# EAGLE schematic cape-c (EAGLE 6.6.0)
DATABASE: ../partsdb.txt
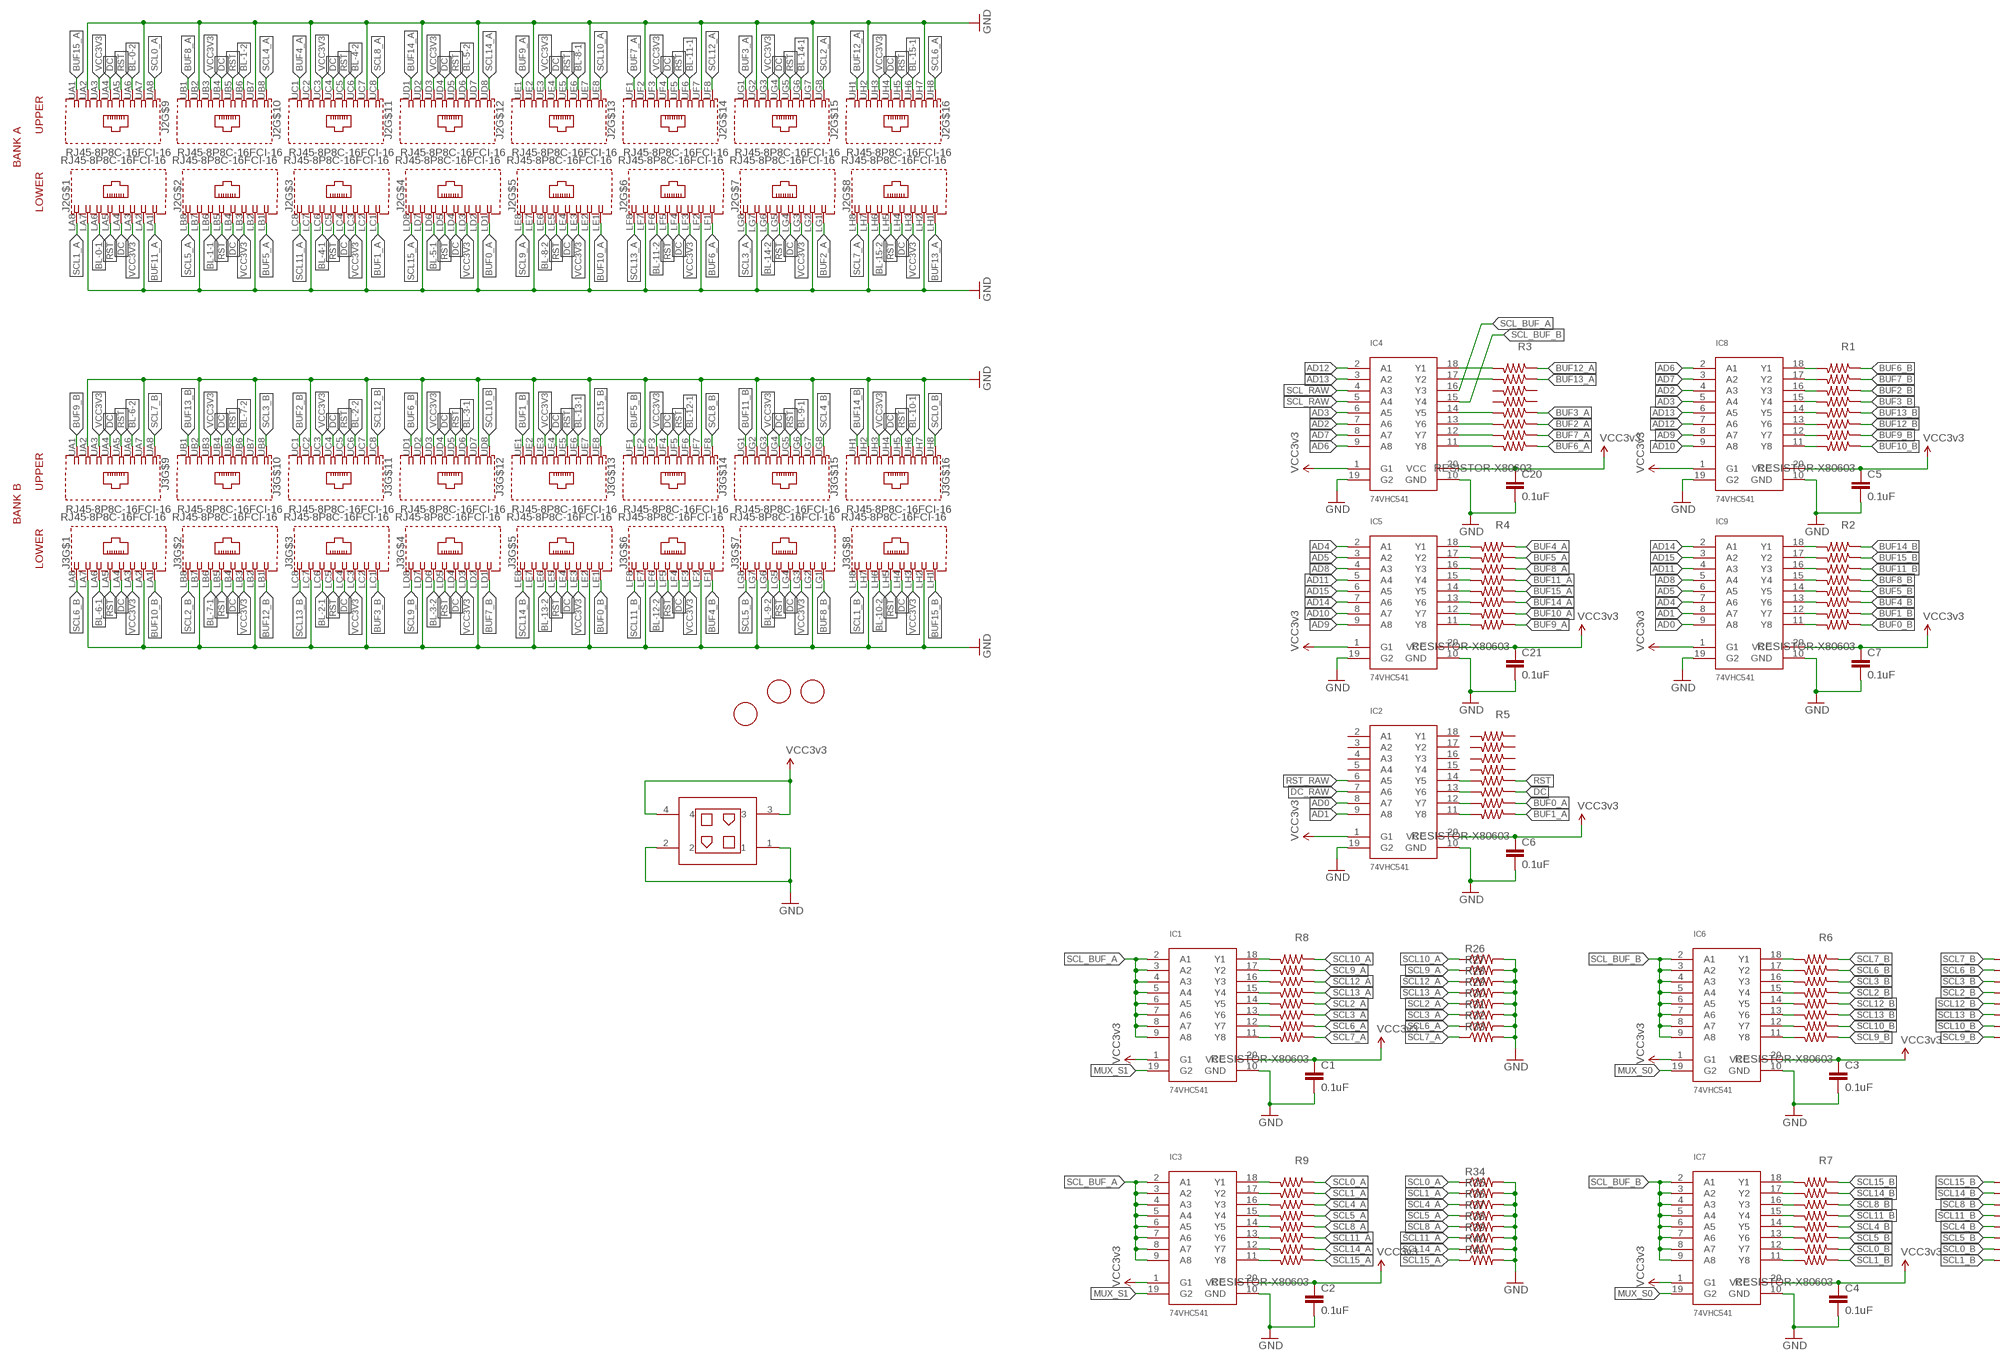
[diagram p0: schematic, sheet 1, part 1 of 2]
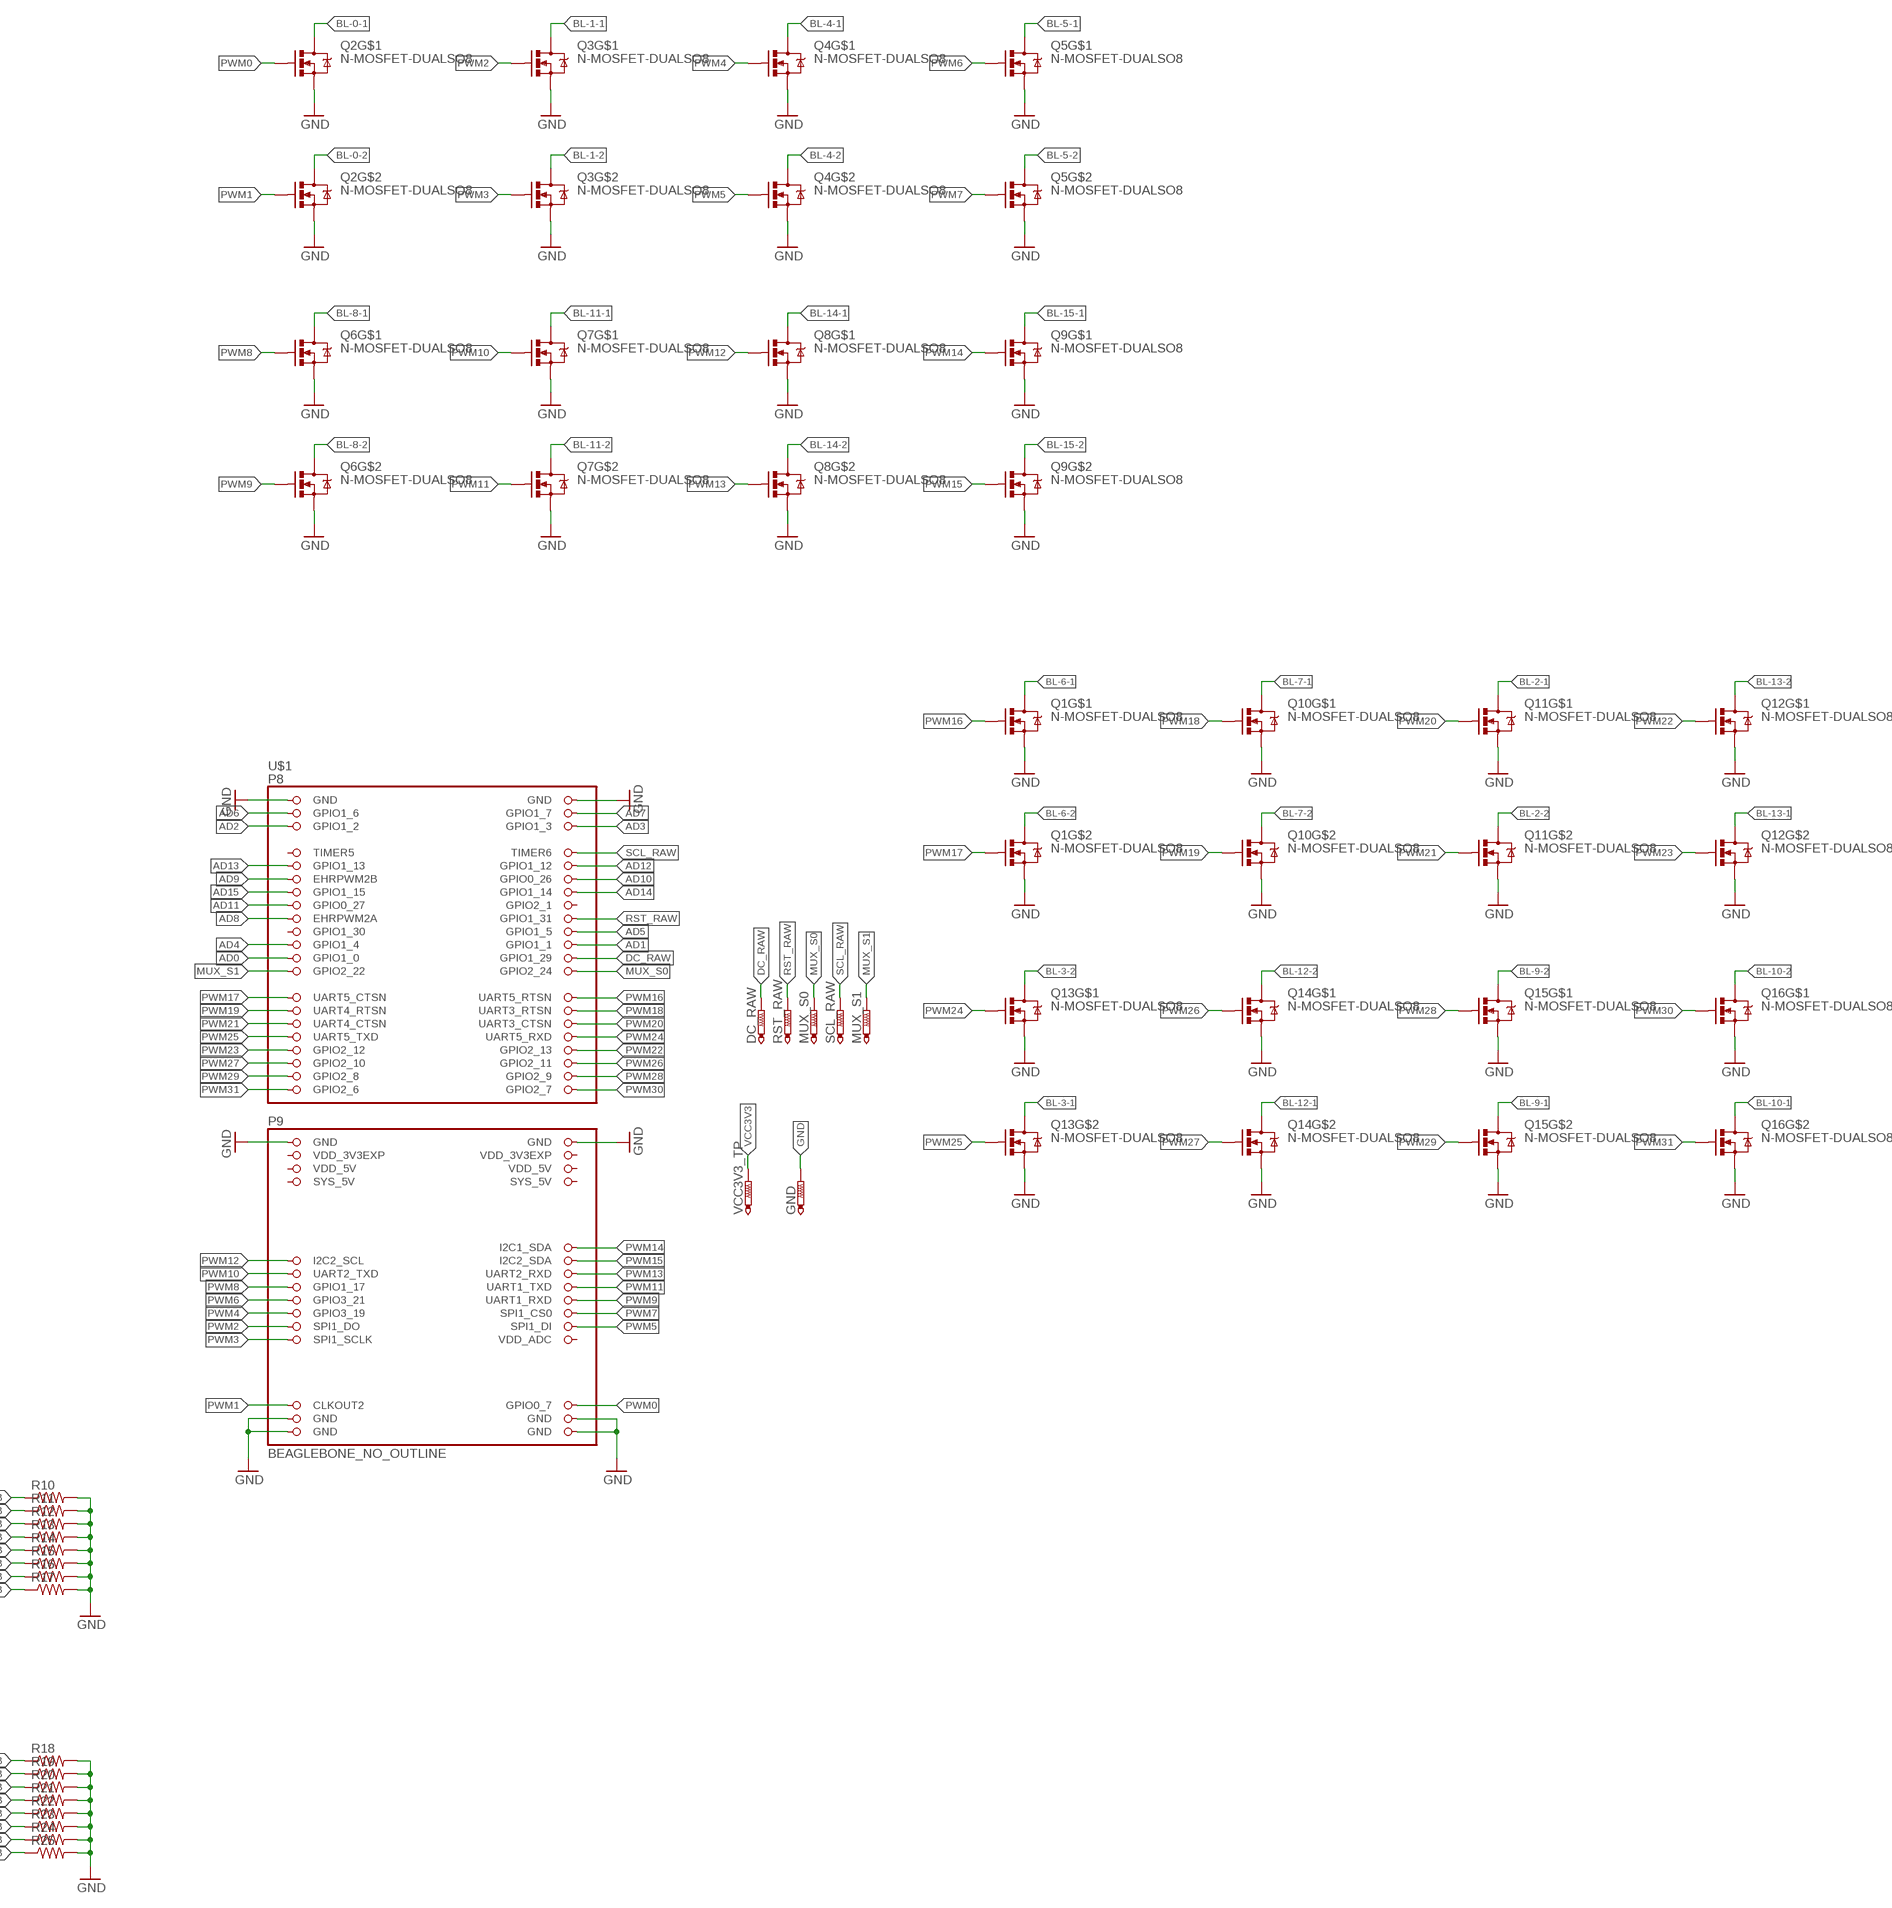
[diagram p1: schematic, sheet 1, part 2 of 2]

## Parts
C1  0.1uF  CAP0805  [0805]
C2  0.1uF  CAP0805  [0805]
C3  0.1uF  CAP0805  [0805]
C4  0.1uF  CAP0805  [0805]
C5  0.1uF  CAP0805  [0805]
C6  0.1uF  CAP0805  [0805]
C7  0.1uF  CAP0805  [0805]
C20  0.1uF  CAP0805  [0805]
C21  0.1uF  CAP0805  [0805]
DC_RAW  PTR1TP10R  [TP10R]
GND  PTR1TP15SQ  [TP15SQ]
IC1  74VHC541  [TSSOP20]
IC2  74VHC541  [TSSOP20]
IC3  74VHC541  [TSSOP20]
IC4  74VHC541  [TSSOP20]
IC5  74VHC541  [TSSOP20]
IC6  74VHC541  [TSSOP20]
IC7  74VHC541  [TSSOP20]
IC8  74VHC541  [TSSOP20]
IC9  74VHC541  [TSSOP20]
J1  MOLEX-P4  [MOLEX-P4]
J2  RJ45-8P8C-16FCI-16  [FCI-10118074-500A010LF]
J3  RJ45-8P8C-16FCI-16  [FCI-10118074-500A010LF]
MUX_S0  PTR1TP10R  [TP10R]
MUX_S1  PTR1TP10R  [TP10R]
Q1  N-MOSFET-DUALSO8  [SO8]
Q2  N-MOSFET-DUALSO8  [SO8]
Q3  N-MOSFET-DUALSO8  [SO8]
Q4  N-MOSFET-DUALSO8  [SO8]
Q5  N-MOSFET-DUALSO8  [SO8]
Q6  N-MOSFET-DUALSO8  [SO8]
Q7  N-MOSFET-DUALSO8  [SO8]
Q8  N-MOSFET-DUALSO8  [SO8]
Q9  N-MOSFET-DUALSO8  [SO8]
Q10  N-MOSFET-DUALSO8  [SO8]
Q11  N-MOSFET-DUALSO8  [SO8]
Q12  N-MOSFET-DUALSO8  [SO8]
Q13  N-MOSFET-DUALSO8  [SO8]
Q14  N-MOSFET-DUALSO8  [SO8]
Q15  N-MOSFET-DUALSO8  [SO8]
Q16  N-MOSFET-DUALSO8  [SO8]
R1  RESISTOR-X80603  [R0603-X8]
R2  RESISTOR-X80603  [R0603-X8]
R3  RESISTOR-X80603  [R0603-X8]
R4  RESISTOR-X80603  [R0603-X8]
R5  RESISTOR-X80603  [R0603-X8]
R6  RESISTOR-X80603  [R0603-X8]
R7  RESISTOR-X80603  [R0603-X8]
R8  RESISTOR-X80603  [R0603-X8]
R9  RESISTOR-X80603  [R0603-X8]
R10  RESISTOR0603-RES  [0603-RES]
R11  RESISTOR0603-RES  [0603-RES]
R12  RESISTOR0603-RES  [0603-RES]
R13  RESISTOR0603-RES  [0603-RES]
R14  RESISTOR0603-RES  [0603-RES]
R15  RESISTOR0603-RES  [0603-RES]
R16  RESISTOR0603-RES  [0603-RES]
R17  RESISTOR0603-RES  [0603-RES]
R18  RESISTOR0603-RES  [0603-RES]
R19  RESISTOR0603-RES  [0603-RES]
R20  RESISTOR0603-RES  [0603-RES]
R21  RESISTOR0603-RES  [0603-RES]
R22  RESISTOR0603-RES  [0603-RES]
R23  RESISTOR0603-RES  [0603-RES]
R24  RESISTOR0603-RES  [0603-RES]
R25  RESISTOR0603-RES  [0603-RES]
R26  RESISTOR0603-RES  [0603-RES]
R27  RESISTOR0603-RES  [0603-RES]
R28  RESISTOR0603-RES  [0603-RES]
R29  RESISTOR0603-RES  [0603-RES]
R30  RESISTOR0603-RES  [0603-RES]
R31  RESISTOR0603-RES  [0603-RES]
R32  RESISTOR0603-RES  [0603-RES]
R33  RESISTOR0603-RES  [0603-RES]
R34  RESISTOR0603-RES  [0603-RES]
R35  RESISTOR0603-RES  [0603-RES]
R36  RESISTOR0603-RES  [0603-RES]
R37  RESISTOR0603-RES  [0603-RES]
R38  RESISTOR0603-RES  [0603-RES]
R39  RESISTOR0603-RES  [0603-RES]
R40  RESISTOR0603-RES  [0603-RES]
R41  RESISTOR0603-RES  [0603-RES]
RST_RAW  PTR1TP10R  [TP10R]
SCL_RAW  PTR1TP10R  [TP10R]
U$1  BEAGLEBONE_NO_OUTLINE  [BEAGLEBONE_SHIELD_NO_OUTLINE]
U$4  FIDUCIAL  [FIDUCIAL_1MM]
U$5  FIDUCIAL  [FIDUCIAL_1MM]
U$6  FIDUCIAL  [FIDUCIAL_1MM]
VCC3V3_TP  PTR1TP15R  [TP15R]

## Nets
AD0: IC2.8(A7) IC9.9(A8) U$1.25(GPIO1_0)
AD1: IC2.9(A8) IC9.8(A7) U$1.24(GPIO1_1)
AD2: IC4.7(A6) IC8.4(A3) U$1.5(GPIO1_2)
AD3: IC4.6(A5) IC8.5(A4) U$1.6(GPIO1_3)
AD4: IC5.2(A1) IC9.7(A6) U$1.23(GPIO1_4)
AD5: IC5.3(A2) IC9.6(A5) U$1.22(GPIO1_5)
AD6: IC4.9(A8) IC8.2(A1) U$1.3(GPIO1_6)
AD7: IC4.8(A7) IC8.3(A2) U$1.4(GPIO1_7)
AD8: IC5.4(A3) IC9.5(A4) U$1.19(EHRPWM2A)
AD9: IC5.9(A8) IC8.8(A7) U$1.13(EHRPWM2B)
AD10: IC5.8(A7) IC8.9(A8) U$1.14(GPIO0_26)
AD11: IC5.5(A4) IC9.4(A3) U$1.17(GPIO0_27)
AD12: IC4.2(A1) IC8.7(A6) U$1.12(GPIO1_12)
AD13: IC4.3(A2) IC8.6(A5) U$1.11(GPIO1_13)
AD14: IC5.7(A6) IC9.2(A1) U$1.16(GPIO1_14)
AD15: IC5.6(A5) IC9.3(A2) U$1.15(GPIO1_15)
BL-0-1: J2.LA6 Q2.7(D) Q2.8(D)
BL-0-2: J2.UA6 Q2.5(D) Q2.6(D)
BL-1-1: J2.LB6 Q3.7(D) Q3.8(D)
BL-1-2: J2.UB6 Q3.5(D) Q3.6(D)
BL-2-1: J3.LC6 Q11.7(D) Q11.8(D)
BL-2-2: J3.UC6 Q11.5(D) Q11.6(D)
BL-3-1: J3.UD6 Q13.5(D) Q13.6(D)
BL-3-2: J3.LD6 Q13.7(D) Q13.8(D)
BL-4-1: J2.LC6 Q4.7(D) Q4.8(D)
BL-4-2: J2.UC6 Q4.5(D) Q4.6(D)
BL-5-1: J2.LD6 Q5.7(D) Q5.8(D)
BL-5-2: J2.UD6 Q5.5(D) Q5.6(D)
BL-6-1: J3.LA6 Q1.7(D) Q1.8(D)
BL-6-2: J3.UA6 Q1.5(D) Q1.6(D)
BL-7-1: J3.LB6 Q10.7(D) Q10.8(D)
BL-7-2: J3.UB6 Q10.5(D) Q10.6(D)
BL-8-1: J2.UE6 Q6.7(D) Q6.8(D)
BL-8-2: J2.LE6 Q6.5(D) Q6.6(D)
BL-9-1: J3.UG6 Q15.5(D) Q15.6(D)
BL-9-2: J3.LG6 Q15.7(D) Q15.8(D)
BL-10-1: J3.UH6 Q16.5(D) Q16.6(D)
BL-10-2: J3.LH6 Q16.7(D) Q16.8(D)
BL-11-1: J2.UF6 Q7.7(D) Q7.8(D)
BL-11-2: J2.LF6 Q7.5(D) Q7.6(D)
BL-12-1: J3.UF6 Q14.5(D) Q14.6(D)
BL-12-2: J3.LF6 Q14.7(D) Q14.8(D)
BL-13-1: J3.UE6 Q12.5(D) Q12.6(D)
BL-13-2: J3.LE6 Q12.7(D) Q12.8(D)
BL-14-1: J2.UG6 Q8.7(D) Q8.8(D)
BL-14-2: J2.LG6 Q8.5(D) Q8.6(D)
BL-15-1: J2.UH6 Q9.7(D) Q9.8(D)
BL-15-2: J2.LH6 Q9.5(D) Q9.6(D)
BUF0_A: J2.LD1 R5.7A(7B)
BUF0_B: J3.LE1 R2.8A(8B)
BUF1_A: J2.LC1 R5.8A(8B)
BUF1_B: J3.UE1 R2.7A(7B)
BUF2_A: J2.LG1 R3.6A(6B)
BUF2_B: J3.UC1 R1.3A(3B)
BUF3_A: J2.UG1 R3.5A(5B)
BUF3_B: J3.LC1 R1.4A(4B)
BUF4_A: J2.UC1 R4.1A(1B)
BUF4_B: J3.LF1 R2.6A(6B)
BUF5_A: J2.LB1 R4.2A(2B)
BUF5_B: J3.UF1 R2.5A(5B)
BUF6_A: J2.LF1 R3.8A(8B)
BUF6_B: J3.UD1 R1.1A(1B)
BUF7_A: J2.UF1 R3.7A(7B)
BUF7_B: J3.LD1 R1.2A(2B)
BUF8_A: J2.UB1 R4.3A(3B)
BUF8_B: J3.LG1 R2.4A(4B)
BUF9_A: J2.UE1 R4.8A(8B)
BUF9_B: J3.UA1 R1.7A(7B)
BUF10_A: J2.LE1 R4.7A(7B)
BUF10_B: J3.LA1 R1.8A(8B)
BUF11_A: J2.LA1 R4.4A(4B)
BUF11_B: J3.UG1 R2.3A(3B)
BUF12_A: J2.UH1 R3.1A(1B)
BUF12_B: J3.LB1 R1.6A(6B)
BUF13_A: J2.LH1 R3.2A(2B)
BUF13_B: J3.UB1 R1.5A(5B)
BUF14_A: J2.UD1 R4.6A(6B)
BUF14_B: J3.UH1 R2.1A(1B)
BUF15_A: J2.UA1 R4.5A(5B)
BUF15_B: J3.LH1 R2.2A(2B)
DC: J2.LA4 J2.LB4 J2.LC4 J2.LD4 J2.LE4 J2.LF4 J2.LG4 J2.LH4 J2.UA4 J2.UB4 J2.UC4 J2.UD4 J2.UE4 J2.UF4 J2.UG4 J2.UH4 J3.LA4 J3.LB4 J3.LC4 J3.LD4 J3.LE4 J3.LF4 J3.LG4 J3.LH4 J3.UA4 J3.UB4 J3.UC4 J3.UD4 J3.UE4 J3.UF4 J3.UG4 J3.UH4 R5.6A(6B)
DC_RAW: DC_RAW.TP IC2.7(A6) U$1.26(GPIO1_29)
GND: C1.2 C2.2 C3.2 C4.2 C5.2 C6.2 C7.2 C20.2 C21.2 GND.TP IC1.10(GND) IC2.10(GND) IC2.19(G2) IC3.10(GND) IC4.10(GND) IC4.19(G2) IC5.10(GND) IC5.19(G2) IC6.10(GND) IC7.10(GND) IC8.10(GND) IC8.19(G2) IC9.10(GND) IC9.19(G2) J1.1 J1.2 J2.LA2 J2.LA7 J2.LB2 J2.LB7 J2.LC2 J2.LC7 J2.LD2 J2.LD7 J2.LE2 J2.LE7 J2.LF2 J2.LF7 J2.LG2 J2.LG7 J2.LH2 J2.LH7 J2.UA2 J2.UA7 J2.UB2 J2.UB7 J2.UC2 J2.UC7 J2.UD2 J2.UD7 J2.UE2 J2.UE7 J2.UF2 J2.UF7 J2.UG2 J2.UG7 J2.UH2 J2.UH7 J3.LA2 J3.LA7 J3.LB2 J3.LB7 J3.LC2 J3.LC7 J3.LD2 J3.LD7 J3.LE2 J3.LE7 J3.LF2 J3.LF7 J3.LG2 J3.LG7 J3.LH2 J3.LH7 J3.UA2 J3.UA7 J3.UB2 J3.UB7 J3.UC2 J3.UC7 J3.UD2 J3.UD7 J3.UE2 J3.UE7 J3.UF2 J3.UF7 J3.UG2 J3.UG7 J3.UH2 J3.UH7 Q1.1(S) Q1.3(S) Q2.1(S) Q2.3(S) Q3.1(S) Q3.3(S) Q4.1(S) Q4.3(S) Q5.1(S) Q5.3(S) Q6.1(S) Q6.3(S) Q7.1(S) Q7.3(S) Q8.1(S) Q8.3(S) Q9.1(S) Q9.3(S) Q10.1(S) Q10.3(S) Q11.1(S) Q11.3(S) Q12.1(S) Q12.3(S) Q13.1(S) Q13.3(S) Q14.1(S) Q14.3(S) Q15.1(S) Q15.3(S) Q16.1(S) Q16.3(S) R10.2 R11.2 R12.2 R13.2 R14.2 R15.2 R16.2 R17.2 R18.2 R19.2 R20.2 R21.2 R22.2 R23.2 R24.2 R25.2 R26.2 R27.2 R28.2 R29.2 R30.2 R31.2 R32.2 R33.2 R34.2 R35.2 R36.2 R37.2 R38.2 R39.2 R40.2 R41.2 U$1.1(GND) U$1.2(GND) U$1.47(GND) U$1.48(GND) U$1.89(GND) U$1.90(GND) U$1.91(GND) U$1.92(GND)
MUX_S0: IC6.19(G2) IC7.19(G2) MUX_S0.TP U$1.28(GPIO2_24)
MUX_S1: IC1.19(G2) IC3.19(G2) MUX_S1.TP U$1.27(GPIO2_22)
N$5: IC2.14(Y5) R5.5B(5A)
N$6: IC2.13(Y6) R5.6B(6A)
N$7: IC8.18(Y1) R1.1B(1A)
N$8: IC8.17(Y2) R1.2B(2A)
N$9: IC8.16(Y3) R1.3B(3A)
N$10: IC8.15(Y4) R1.4B(4A)
N$11: IC8.14(Y5) R1.5B(5A)
N$12: IC8.13(Y6) R1.6B(6A)
N$13: IC8.12(Y7) R1.7B(7A)
N$14: IC8.11(Y8) R1.8B(8A)
N$15: IC9.18(Y1) R2.1B(1A)
N$16: IC9.17(Y2) R2.2B(2A)
N$17: IC9.16(Y3) R2.3B(3A)
N$18: IC9.15(Y4) R2.4B(4A)
N$19: IC9.14(Y5) R2.5B(5A)
N$20: IC9.13(Y6) R2.6B(6A)
N$21: IC9.12(Y7) R2.7B(7A)
N$22: IC9.11(Y8) R2.8B(8A)
N$23: IC5.18(Y1) R4.1B(1A)
N$24: IC5.17(Y2) R4.2B(2A)
N$25: IC5.16(Y3) R4.3B(3A)
N$26: IC5.15(Y4) R4.4B(4A)
N$27: IC5.13(Y6) R4.6B(6A)
N$28: IC5.14(Y5) R4.5B(5A)
N$29: IC5.12(Y7) R4.7B(7A)
N$30: IC5.11(Y8) R4.8B(8A)
N$31: IC4.18(Y1) R3.1B(1A)
N$32: IC4.17(Y2) R3.2B(2A)
N$33: IC6.18(Y1) R6.1B(1A)
N$34: IC2.12(Y7) R5.7B(7A)
N$35: IC4.14(Y5) R3.5B(5A)
N$36: IC4.13(Y6) R3.6B(6A)
N$37: IC4.12(Y7) R3.7B(7A)
N$38: IC4.11(Y8) R3.8B(8A)
N$39: IC2.11(Y8) R5.8B(8A)
N$40: IC6.17(Y2) R6.2B(2A)
N$41: IC6.16(Y3) R6.3B(3A)
N$42: IC6.15(Y4) R6.4B(4A)
N$43: IC6.14(Y5) R6.5B(5A)
N$44: IC6.13(Y6) R6.6B(6A)
N$45: IC6.12(Y7) R6.7B(7A)
N$46: IC6.11(Y8) R6.8B(8A)
N$47: IC7.18(Y1) R7.1B(1A)
N$48: IC7.17(Y2) R7.2B(2A)
N$49: IC7.15(Y4) R7.4B(4A)
N$50: IC7.16(Y3) R7.3B(3A)
N$51: IC7.14(Y5) R7.5B(5A)
N$52: IC7.12(Y7) R7.7B(7A)
N$53: IC7.13(Y6) R7.6B(6A)
N$54: IC7.11(Y8) R7.8B(8A)
N$55: IC1.18(Y1) R8.1B(1A)
N$56: IC1.17(Y2) R8.2B(2A)
N$57: IC1.16(Y3) R8.3B(3A)
N$58: IC1.15(Y4) R8.4B(4A)
N$59: IC1.14(Y5) R8.5B(5A)
N$60: IC1.13(Y6) R8.6B(6A)
N$61: IC1.12(Y7) R8.7B(7A)
N$62: IC1.11(Y8) R8.8B(8A)
N$63: IC3.18(Y1) R9.1B(1A)
N$64: IC3.17(Y2) R9.2B(2A)
N$65: IC3.16(Y3) R9.3B(3A)
N$66: IC3.15(Y4) R9.4B(4A)
N$67: IC3.14(Y5) R9.5B(5A)
N$68: IC3.13(Y6) R9.6B(6A)
N$69: IC3.12(Y7) R9.7B(7A)
N$70: IC3.11(Y8) R9.8B(8A)
PWM0: Q2.2(G) U$1.88(GPIO0_7)
PWM1: Q2.4(G) U$1.87(CLKOUT2)
PWM2: Q3.2(G) U$1.75(SPI1_DO)
PWM3: Q3.4(G) U$1.77(SPI1_SCLK)
PWM4: Q4.2(G) U$1.73(GPIO3_19)
PWM5: Q4.4(G) U$1.76(SPI1_DI)
PWM6: Q5.2(G) U$1.71(GPIO3_21)
PWM7: Q5.4(G) U$1.74(SPI1_CS0)
PWM8: Q6.2(G) U$1.69(GPIO1_17)
PWM9: Q6.4(G) U$1.72(UART1_RXD)
PWM10: Q7.2(G) U$1.67(UART2_TXD)
PWM11: Q7.4(G) U$1.70(UART1_TXD)
PWM12: Q8.2(G) U$1.65(I2C2_SCL)
PWM13: Q8.4(G) U$1.68(UART2_RXD)
PWM14: Q9.2(G) U$1.64(I2C1_SDA)
PWM15: Q9.4(G) U$1.66(I2C2_SDA)
PWM16: Q1.2(G) U$1.32(UART5_RTSN)
PWM17: Q1.4(G) U$1.31(UART5_CTSN)
PWM18: Q10.2(G) U$1.34(UART3_RTSN)
PWM19: Q10.4(G) U$1.33(UART4_RTSN)
PWM20: Q11.2(G) U$1.36(UART3_CTSN)
PWM21: Q11.4(G) U$1.35(UART4_CTSN)
PWM22: Q12.2(G) U$1.40(GPIO2_13)
PWM23: Q12.4(G) U$1.39(GPIO2_12)
PWM24: Q13.2(G) U$1.38(UART5_RXD)
PWM25: Q13.4(G) U$1.37(UART5_TXD)
PWM26: Q14.2(G) U$1.42(GPIO2_11)
PWM27: Q14.4(G) U$1.41(GPIO2_10)
PWM28: Q15.2(G) U$1.44(GPIO2_9)
PWM29: Q15.4(G) U$1.43(GPIO2_8)
PWM30: Q16.2(G) U$1.46(GPIO2_7)
PWM31: Q16.4(G) U$1.45(GPIO2_6)
RST: J2.LA5 J2.LB5 J2.LC5 J2.LD5 J2.LE5 J2.LF5 J2.LG5 J2.LH5 J2.UA5 J2.UB5 J2.UC5 J2.UD5 J2.UE5 J2.UF5 J2.UG5 J2.UH5 J3.LA5 J3.LB5 J3.LC5 J3.LD5 J3.LE5 J3.LF5 J3.LG5 J3.LH5 J3.UA5 J3.UB5 J3.UC5 J3.UD5 J3.UE5 J3.UF5 J3.UG5 J3.UH5 R5.5A(5B)
RST_RAW: IC2.6(A5) RST_RAW.TP U$1.20(GPIO1_31)
SCL0_A: J2.UA8 R9.1A(1B) R34.1
SCL0_B: J3.UH8 R7.7A(7B) R24.1
SCL1_A: J2.LA8 R9.2A(2B) R35.1
SCL1_B: J3.LH8 R7.8A(8B) R25.1
SCL2_A: J2.UG8 R8.5A(5B) R30.1
SCL2_B: J3.LB8 R6.4A(4B) R13.1
SCL3_A: J2.LG8 R8.6A(6B) R31.1
SCL3_B: J3.UB8 R6.3A(3B) R12.1
SCL4_A: J2.UB8 R9.3A(3B) R36.1
SCL4_B: J3.UG8 R7.5A(5B) R22.1
SCL5_A: J2.LB8 R9.4A(4B) R37.1
SCL5_B: J3.LG8 R7.6A(6B) R23.1
SCL6_A: J2.UH8 R8.7A(7B) R32.1
SCL6_B: J3.LA8 R6.2A(2B) R11.1
SCL7_A: J2.LH8 R8.8A(8B) R33.1
SCL7_B: J3.UA8 R6.1A(1B) R10.1
SCL8_A: J2.UC8 R9.5A(5B) R38.1
SCL8_B: J3.UF8 R7.3A(3B) R20.1
SCL9_A: J2.LE8 R8.2A(2B) R27.1
SCL9_B: J3.LD8 R6.8A(8B) R17.1
SCL10_A: J2.UE8 R8.1A(1B) R26.1
SCL10_B: J3.UD8 R6.7A(7B) R16.1
SCL11_A: J2.LC8 R9.6A(6B) R39.1
SCL11_B: J3.LF8 R7.4A(4B) R21.1
SCL12_A: J2.UF8 R8.3A(3B) R28.1
SCL12_B: J3.UC8 R6.5A(5B) R14.1
SCL13_A: J2.LF8 R8.4A(4B) R29.1
SCL13_B: J3.LC8 R6.6A(6B) R15.1
SCL14_A: J2.UD8 R9.7A(7B) R40.1
SCL14_B: J3.LE8 R7.2A(2B) R19.1
SCL15_A: J2.LD8 R9.8A(8B) R41.1
SCL15_B: J3.UE8 R7.1A(1B) R18.1
SCL_BUF_A: IC1.2(A1) IC1.3(A2) IC1.4(A3) IC1.5(A4) IC1.6(A5) IC1.7(A6) IC1.8(A7) IC1.9(A8) IC3.2(A1) IC3.3(A2) IC3.4(A3) IC3.5(A4) IC3.6(A5) IC3.7(A6) IC3.8(A7) IC3.9(A8) IC4.16(Y3)
SCL_BUF_B: IC4.15(Y4) IC6.2(A1) IC6.3(A2) IC6.4(A3) IC6.5(A4) IC6.6(A5) IC6.7(A6) IC6.8(A7) IC6.9(A8) IC7.2(A1) IC7.3(A2) IC7.4(A3) IC7.5(A4) IC7.6(A5) IC7.7(A6) IC7.8(A7) IC7.9(A8)
SCL_RAW: IC4.4(A3) IC4.5(A4) SCL_RAW.TP U$1.10(TIMER6)
VCC3V3: C1.1 C2.1 C3.1 C4.1 C5.1 C6.1 C7.1 C20.1 C21.1 IC1.1(G1) IC1.20(VCC) IC2.1(G1) IC2.20(VCC) IC3.1(G1) IC3.20(VCC) IC4.1(G1) IC4.20(VCC) IC5.1(G1) IC5.20(VCC) IC6.1(G1) IC6.20(VCC) IC7.1(G1) IC7.20(VCC) IC8.1(G1) IC8.20(VCC) IC9.1(G1) IC9.20(VCC) J1.3 J1.4 J2.LA3 J2.LB3 J2.LC3 J2.LD3 J2.LE3 J2.LF3 J2.LG3 J2.LH3 J2.UA3 J2.UB3 J2.UC3 J2.UD3 J2.UE3 J2.UF3 J2.UG3 J2.UH3 J3.LA3 J3.LB3 J3.LC3 J3.LD3 J3.LE3 J3.LF3 J3.LG3 J3.LH3 J3.UA3 J3.UB3 J3.UC3 J3.UD3 J3.UE3 J3.UF3 J3.UG3 J3.UH3 VCC3V3_TP.TP ; supply symbol labelled VCC3v3
Unconnected: IC2.2(A1) IC2.3(A2) IC2.4(A3) IC2.5(A4) IC2.15(Y4) IC2.16(Y3) IC2.17(Y2) IC2.18(Y1) R3.3A(3B) R3.3B(3A) R3.4A(4B) R3.4B(4A) R5.1A(1B) R5.1B(1A) R5.2A(2B) R5.2B(2A) R5.3A(3B) R5.3B(3A) R5.4A(4B) R5.4B(4A) U$1.9(TIMER5) U$1.18(GPIO2_1) U$1.21(GPIO1_30) U$1.54(SYS_5V) U$1.78(VDD_ADC)

## Notes on the sheet
- UPPER
- BANK A
- LOWER
- UPPER
- BANK B
- LOWER

## Power pins joined to a net without a drawn wire
SYS_5V: U$1.53(SYS_5V)
VDD_3V3EXP: U$1.49(VDD_3V3EXP) U$1.50(VDD_3V3EXP)
VDD_5V: U$1.51(VDD_5V) U$1.52(VDD_5V)

## Library data of the parts
C1-C7 C20 C21 = SparkFun-Capacitors:CAP: Capacitor Standard 0603 ceramic capacitor, and 0.1" leaded capacitor.
DC_RAW GND MUX_S0 MUX_S1 RST_RAW SCL_RAW VCC3V3_TP = tenna_avr_AD7021_v0_9_shrink:PTR1: TEST PIN .063mm, 25mil circular test point
IC1-IC9 = cape:74VHC541; PARTNO: MC74LCX245DTR2G
J1 = cape:MOLEX-P4
J2 J3 = cape:RJ45-8P8C-16; PARTNO: 10118074-500A010LF
Q1-Q16 = cape:N-MOSFET-DUAL; PARTNO: DMN6040SSD-13
R1-R9 = cape:RESISTOR-X8; PARTNO: 742C163220JP
R10-R41 = SparkFun-Passives:RESISTOR: Resistor Basic schematic elements and footprints for 0603, 1206, and PTH resistors.
U$1 = LEDscape:BEAGLEBONE_NO_OUTLINE: Should match A3 pinout - but not completely tested
U$4-U$6 = adafruit:FIDUCIAL: For use by pick and place machines to calibrate the vision/machine, 1mm By microbuilder.eu